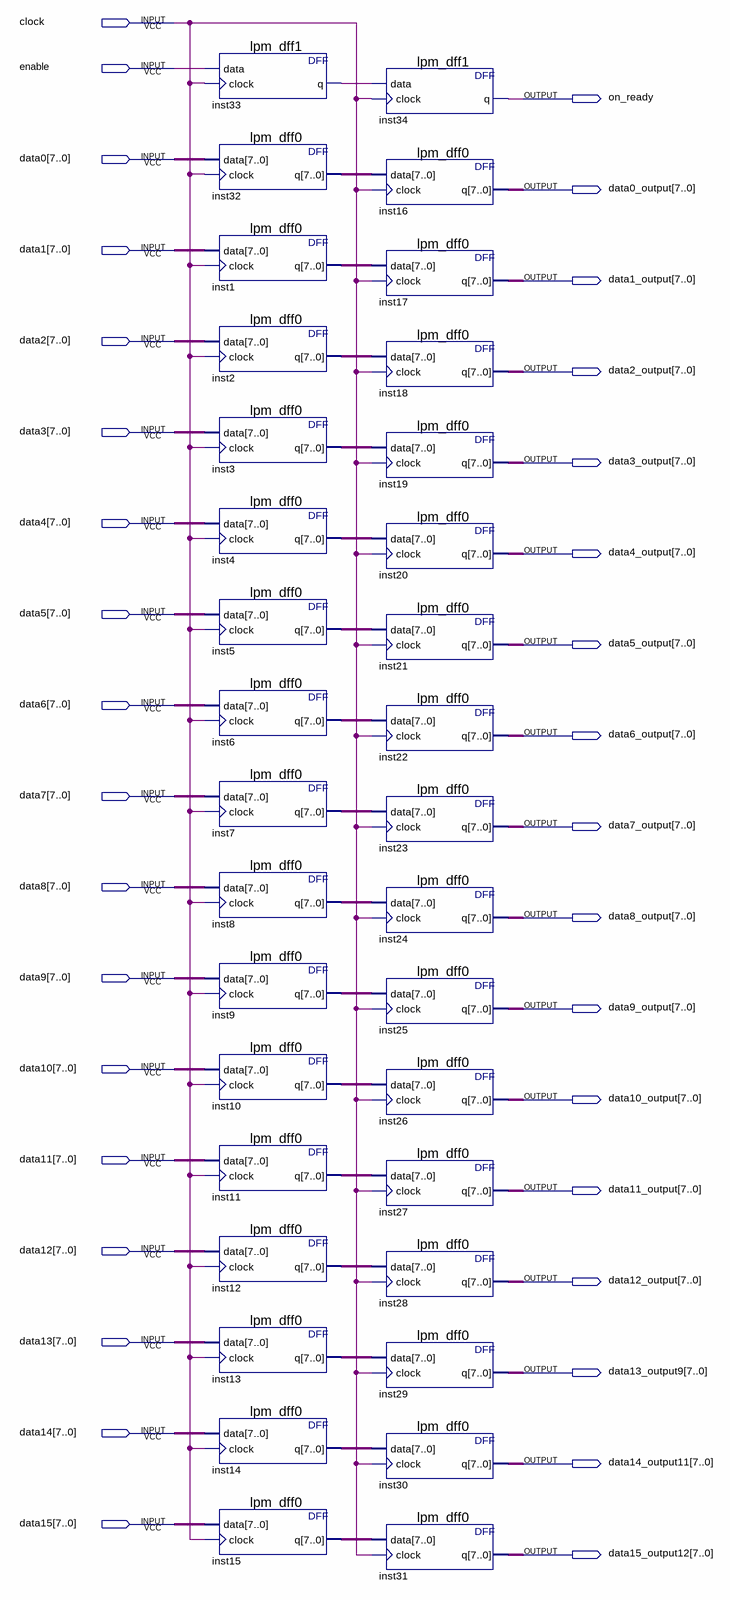
[diagram p0: schematic sheet]
// Quartus schematic sub_bytes.bdf as structural Verilog: 34 symbols, 35 pins
module sub_bytes (
  input  clock,
  input  enable,
  input  [7:0] data0,
  input  [7:0] data1,
  input  [7:0] data2,
  input  [7:0] data3,
  input  [7:0] data4,
  input  [7:0] data5,
  input  [7:0] data6,
  input  [7:0] data7,
  input  [7:0] data8,
  input  [7:0] data9,
  input  [7:0] data10,
  input  [7:0] data11,
  input  [7:0] data12,
  input  [7:0] data13,
  input  [7:0] data14,
  input  [7:0] data15,
  output on_ready,
  output [7:0] data0_output,
  output [7:0] data1_output,
  output [7:0] data2_output,
  output [7:0] data3_output,
  output [7:0] data4_output,
  output [7:0] data5_output,
  output [7:0] data6_output,
  output [7:0] data7_output,
  output [7:0] data8_output,
  output [7:0] data9_output,
  output [7:0] data10_output,
  output [7:0] data11_output,
  output [7:0] data12_output,
  output [7:0] data13_output9,
  output [7:0] data14_output11,
  output [7:0] data15_output12
);

  wire inst33_q;
  wire [7:0] inst1_q, inst2_q, inst3_q, inst4_q, inst5_q, inst6_q, inst7_q, inst8_q, inst9_q, inst10_q,
       inst11_q, inst12_q, inst13_q, inst14_q, inst15_q, inst32_q;

  lpm_dff1 inst33 (.data(enable), .clock(clock), .q(inst33_q));
  lpm_dff0 inst32 (.data(data0), .clock(clock), .q(inst32_q));
  lpm_dff0 inst1 (.data(data1), .clock(clock), .q(inst1_q));
  lpm_dff0 inst2 (.data(data2), .clock(clock), .q(inst2_q));
  lpm_dff0 inst3 (.data(data3), .clock(clock), .q(inst3_q));
  lpm_dff0 inst4 (.data(data4), .clock(clock), .q(inst4_q));
  lpm_dff0 inst5 (.data(data5), .clock(clock), .q(inst5_q));
  lpm_dff0 inst6 (.data(data6), .clock(clock), .q(inst6_q));
  lpm_dff0 inst7 (.data(data7), .clock(clock), .q(inst7_q));
  lpm_dff0 inst8 (.data(data8), .clock(clock), .q(inst8_q));
  lpm_dff0 inst9 (.data(data9), .clock(clock), .q(inst9_q));
  lpm_dff0 inst10 (.data(data10), .clock(clock), .q(inst10_q));
  lpm_dff0 inst11 (.data(data11), .clock(clock), .q(inst11_q));
  lpm_dff0 inst12 (.data(data12), .clock(clock), .q(inst12_q));
  lpm_dff0 inst13 (.data(data13), .clock(clock), .q(inst13_q));
  lpm_dff0 inst14 (.data(data14), .clock(clock), .q(inst14_q));
  lpm_dff0 inst15 (.data(data15), .clock(clock), .q(inst15_q));
  lpm_dff1 inst34 (.data(inst33_q), .clock(clock), .q(on_ready));
  lpm_dff0 inst16 (.data(inst32_q), .clock(clock), .q(data0_output));
  lpm_dff0 inst17 (.data(inst1_q), .clock(clock), .q(data1_output));
  lpm_dff0 inst18 (.data(inst2_q), .clock(clock), .q(data2_output));
  lpm_dff0 inst19 (.data(inst3_q), .clock(clock), .q(data3_output));
  lpm_dff0 inst20 (.data(inst4_q), .clock(clock), .q(data4_output));
  lpm_dff0 inst21 (.data(inst5_q), .clock(clock), .q(data5_output));
  lpm_dff0 inst22 (.data(inst6_q), .clock(clock), .q(data6_output));
  lpm_dff0 inst23 (.data(inst7_q), .clock(clock), .q(data7_output));
  lpm_dff0 inst24 (.data(inst8_q), .clock(clock), .q(data8_output));
  lpm_dff0 inst25 (.data(inst9_q), .clock(clock), .q(data9_output));
  lpm_dff0 inst26 (.data(inst10_q), .clock(clock), .q(data10_output));
  lpm_dff0 inst27 (.data(inst11_q), .clock(clock), .q(data11_output));
  lpm_dff0 inst28 (.data(inst12_q), .clock(clock), .q(data12_output));
  lpm_dff0 inst29 (.data(inst13_q), .clock(clock), .q(data13_output9));
  lpm_dff0 inst30 (.data(inst14_q), .clock(clock), .q(data14_output11));
  lpm_dff0 inst31 (.data(inst15_q), .clock(clock), .q(data15_output12));
endmodule
